# EAGLE design Amplifier (EAGLE 6.2)
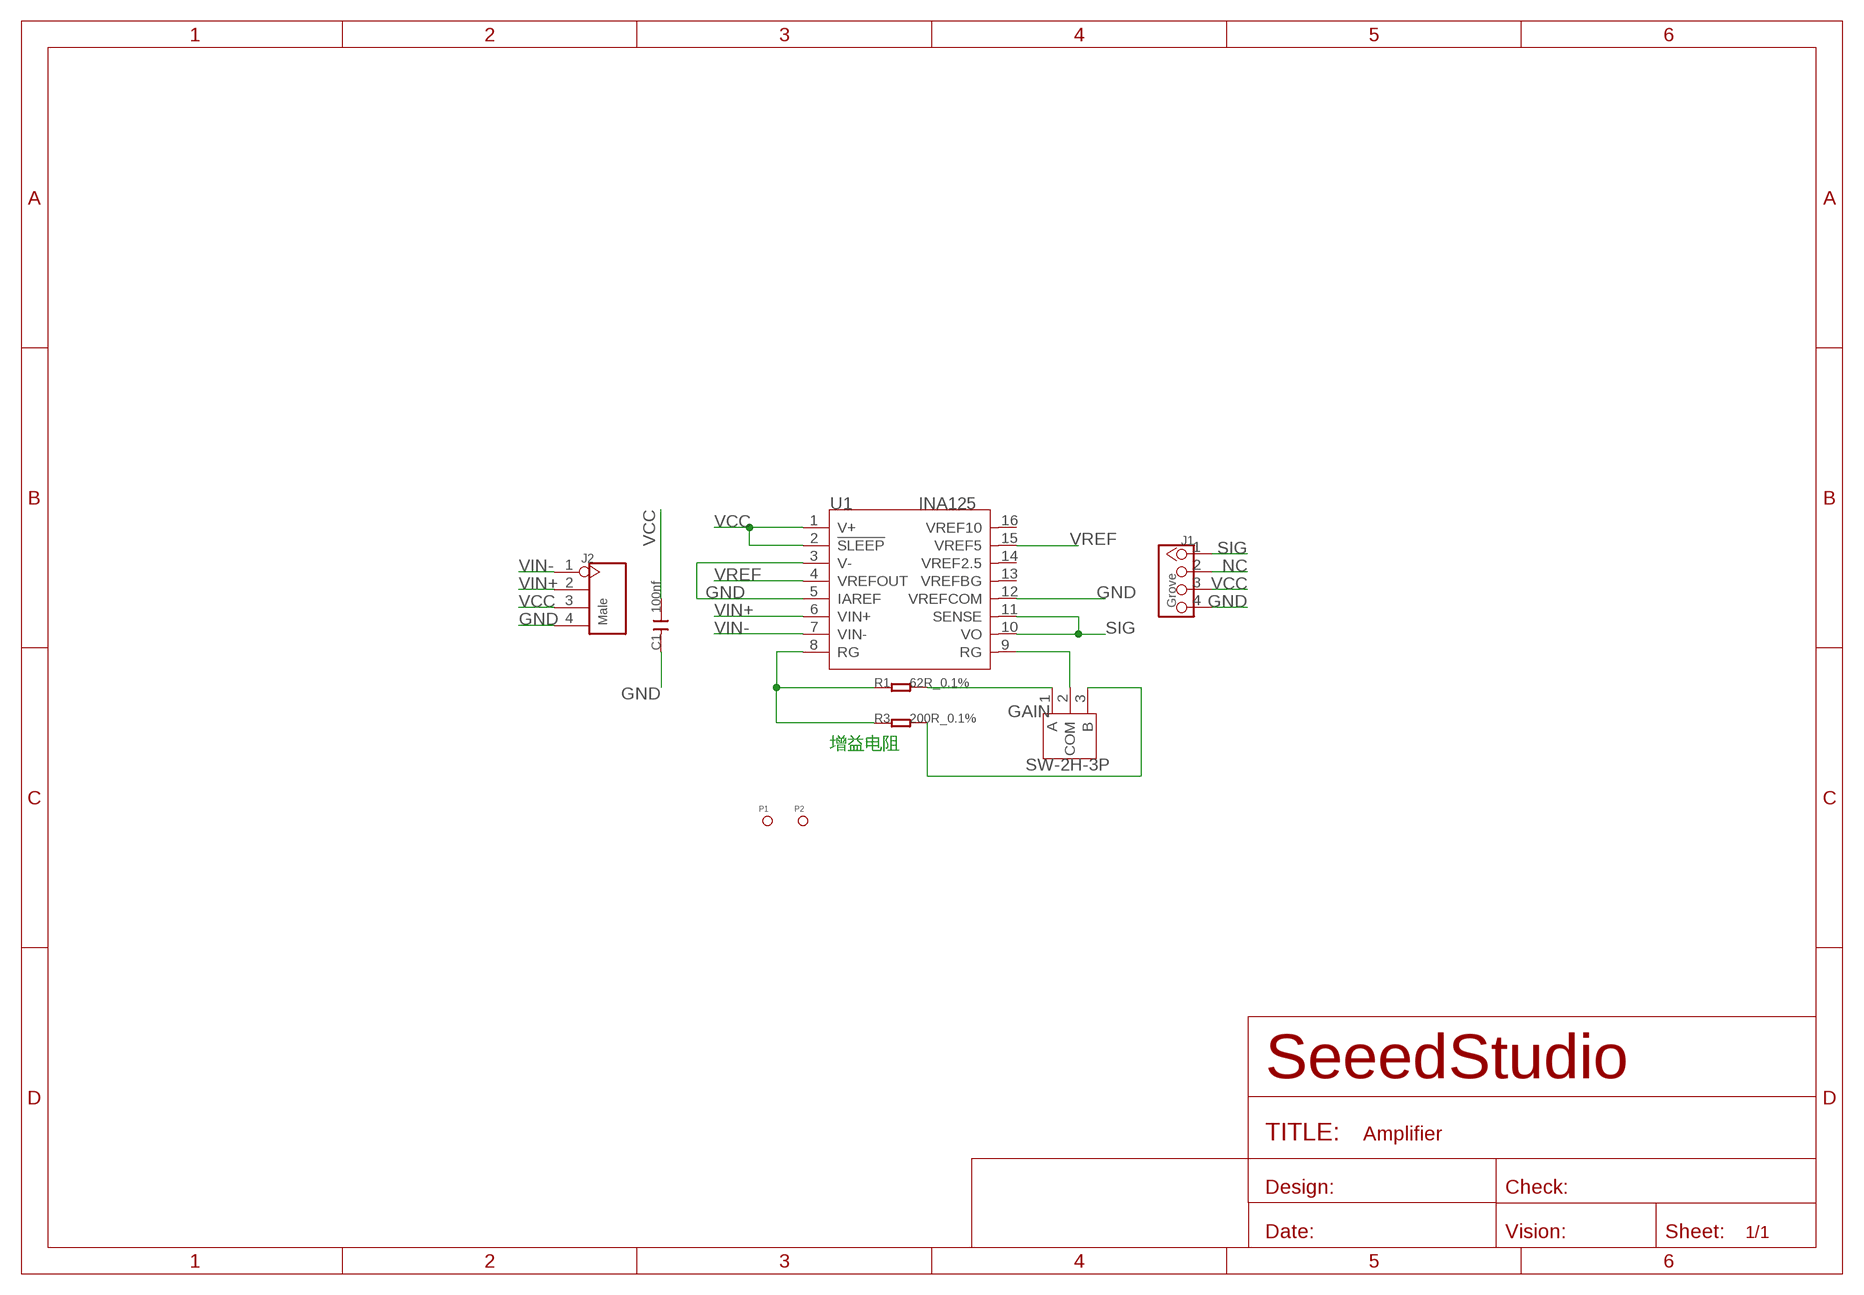
[diagram p0: schematic, sheet 1]

## Parts
C1  100nf  C-0805  [C0805]
GAIN  SW-2H-3P  SWITCH-2H-3P'--'  [3P-2CH-3.54X8.5]
J1  Grove  TWIG-4P-2.0-2.0  [4P-2.0]
J2  Male  HEADER-4P-60/35MIL  [4P-65/35MIL]
P1  PAD-MARK  [ROUND-MARK-1.0]
P2  PAD-MARK  [ROUND-MARK-1.0]
R1  62R_0.1%  R-0805  [R0805]
R3  200R_0.1%  R-0805  [R0805]
U1  INA125  INA125U  [SO16]

## Nets
GND: C1.2 J1.4 J2.4 U1.3(V-) U1.5(IAREF) U1.12(VREFCOM)
N$1: GAIN.2(COM) U1.9(RG)
N$2: GAIN.1(A) R1.2
N$3: GAIN.3(B) R3.2
N$6: R1.1 R3.1 U1.8(RG)
NC: J1.2
SIG: J1.1 U1.10(VO) U1.11(SENSE)
VCC: C1.1 J1.3 J2.3 U1.1(V+) U1.2(!SLEEP)
VIN+: J2.2 U1.6(VIN+)
VIN-: J2.1 U1.7(VIN-)
VREF: U1.4(VREFOUT) U1.15(VREF5)
Unconnected: U1.13(VREFBG) U1.14(VREF2.5) U1.16(VREF10)

## Notes on the sheet
- 增益电阻

## Library data of the parts
C1 = Discrete:C*: Ceramic Capacitors
GAIN = Discrete:SWITCH-2H-3P
J1 = Connector:TWIG-4P-2.0
J2 = Connector:HEADER-4P
P1 P2 = Discrete:PAD-MARK; PARTNO: DNP
R1 R3 = Discrete:R*
U1 = template:INA125: Instrumentation Amplifier With Precision Voltage Renference

## Board
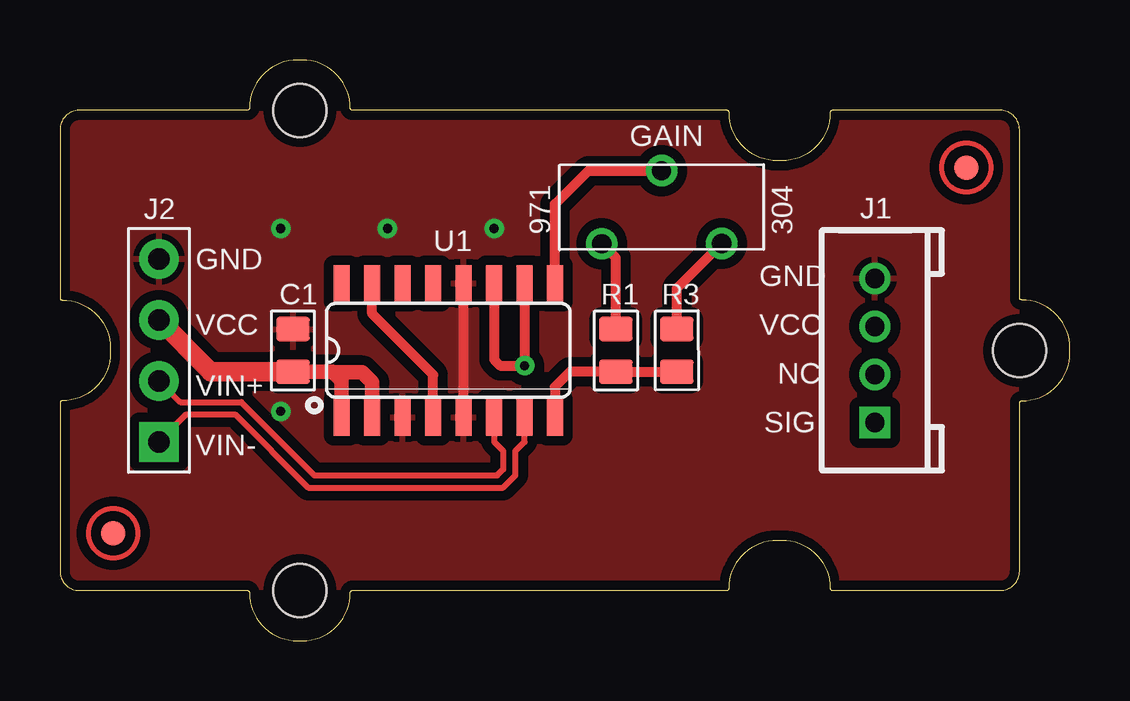
[diagram p1: board, top side]
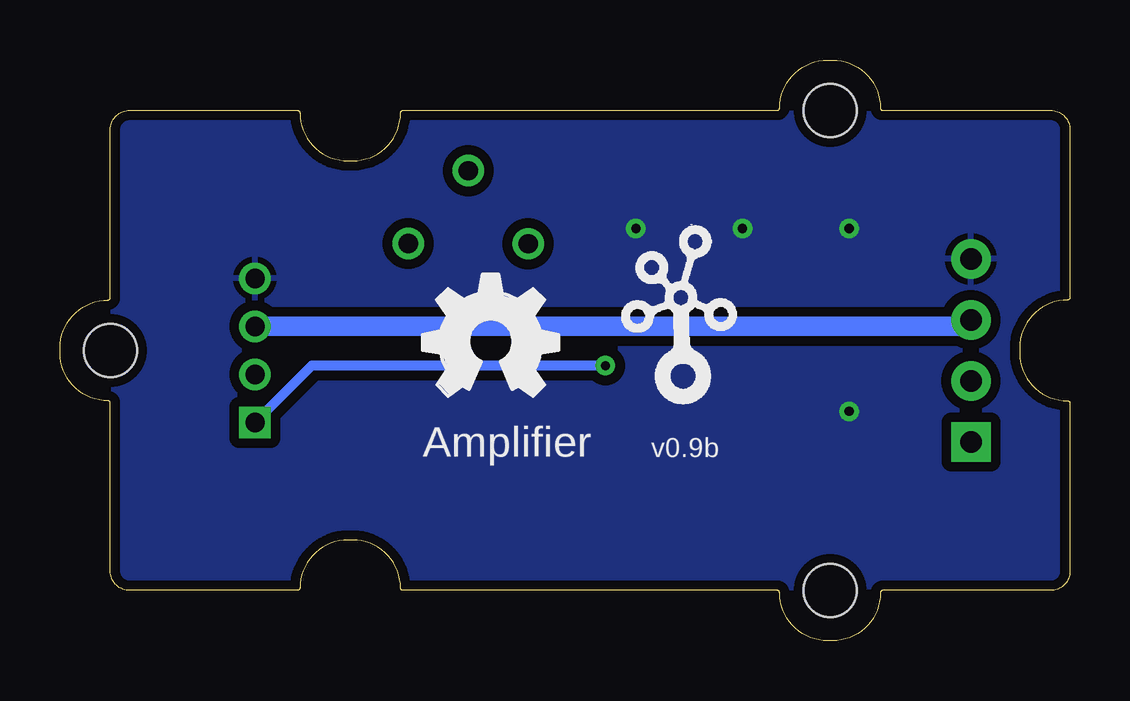
[diagram p2: board, bottom side, seen from below]

Size 42.1 x 24.2 mm. Coordinates in mm from the lower left corner, seen from the top.
Copper layers (1*16): Top 0.035mm / dielectric 1.5mm / Bottom 0.035mm
Design rules: minimum track width 10mil, minimum drill 12mil, track to track 8mil, track to pad 8mil, pad to pad 8mil, via to via 8mil, smd to smd 8mil, copper to edge 10mil, drill to drill 8mil, minimum pad ring 10mil, minimum via ring 8mil, stop-mask expansion 4mil, vias tented up to drill 100mil, thermal gap 10mil

### Footprints (pad centres in the part's own frame; a part is rotated, then mirrored left to right if it is on the bottom)
C0805 = smd 1.016 x 1.397: 1 -0.889,0; 2 0.889,0
3P-2CH-3.54X8.5 = drill 0.8 pad 1.3: 1 -2.5,-1.52; 2 0,1.52; 3 2.5,-1.52
4P-2.0 = drill 0.8 pad 1.27 square: 1 -3,0 | drill 0.8 pad 1.27: 2 -1,0; 3 1,0; 4 3,0
4P-65/35MIL = drill 0.889 pad 1.651 square: 1 0,3.81 | drill 0.889 pad 1.651: 2 0,1.27; 3 0,-1.27; 4 0,-3.81
ROUND-MARK-1.0 = smd 1.016 x 1.016: P$1 0,0
R0805 = smd 1.016 x 1.397: 1 -0.889,0; 2 0.889,0
SO16 = smd 0.66 x 1.524: 1 -4.445,-2.794; 2 -3.175,-2.794; 3 -1.905,-2.794; 4 -0.635,-2.794; 5 0.635,-2.794; 6 1.905,-2.794; 7 3.175,-2.794; 8 4.445,-2.794; 9 4.445,2.794; 10 3.175,2.794; 11 1.905,2.794; 12 0.635,2.794; 13 -0.635,2.794; 14 -1.905,2.794; 15 -3.175,2.794; 16 -4.445,2.794
2U-DIM-W/DRILL = hole 2.2: -10,-10; -10,10; 20,0

### Placement (x,y rotation side)
C1  9.71,12.1 90 top
GAIN  25.08,18.07 0.1 top
J1  33.97,12.1 90 top
J2  4.12,12.1 180 top
P1  37.78,19.72 0 top
P2  2.22,4.48 0 top
R1  23.18,12.1 90 top
R3  25.71,12.1 90.1 top
U1  16.19,12.1 0 top
U$1  [2U-DIM-W/DRILL]  20,12.1 0 top
U$3  [TWIGLOGO]  16.19,10.83 0 bottom
U$4  [OSHW_FILLX200_NOTEXT]  26.98,10.2 0 bottom

### Tracks (layer width: path | path; a pad name or v marks a point on that pad's centre or on a via)
GND  (via drill 0.38 pad 0.81)
  Top 0.406: U1.5 U1.12
  other vias: 9.21,17.18 13.65,17.18 18.09,17.18 9.21,9.56
  pour Bottom (isolate 0.406): -0.32,24.04 42.86,24.04 42.73,-0.6 -0.45,-0.6
  pour Top (isolate 0.406): -0.32,24.04 42.86,24.04 42.73,-0.6 -0.45,-0.6
N$1
  Top 0.406: U1.9 20.64,18.2 22.03,19.59 GAIN.2
N$2
  Top 0.406: R1.2 23.18,15.95 GAIN.1
N$3
  Top 0.406: R3.2 25.71,14.68 GAIN.3
N$6
  Top 0.406: U1.8 20.64,10.58 21.27,11.21 R1.1 R3.1 | R3.1
SIG  (via drill 0.38 pad 0.81)
  Top 0.406: U1.10 v19.36,11.46 18.35,11.46 18.09,11.72 U1.11
  Bottom 0.406: v19.36,11.46 31.61,11.46 J1.1
VCC
  Top 0.61: U1.1 11.74,10.83 11.43,11.15 | 11.43,11.15 11.36,11.21 C1.1 | U1.2 13.02,10.77 12.6,11.19 11.47,11.19 11.43,11.15
  Top 0.813: C1.1 6.28,11.21 J2.3
  Bottom 0.813: J1.3 4.39,13.1 J2.3
VIN+
  Top 0.254: J2.2 5.01,9.94 7.55,9.94 10.6,6.89 18.22,6.89 18.48,7.15 18.48,7.91 18.09,8.29 U1.6
VIN-
  Top 0.254: J2.1 5.27,9.43 7.3,9.43 10.35,6.38 18.48,6.38 18.98,6.89 18.98,7.91 19.36,8.29 U1.7
VREF
  Top 0.406: U1.4 15.55,11.08 13.02,13.62 U1.15

### Text on the board
tPlace: 971 | 304 | GND | GND | VCC | VCC | NC | VIN+ | SIG | VIN-
bPlace: v0.9b | Amplifier